# Altium schematic sheet Lighting.SchDoc
size A; SheetNumber: 3; SheetTotal: 3
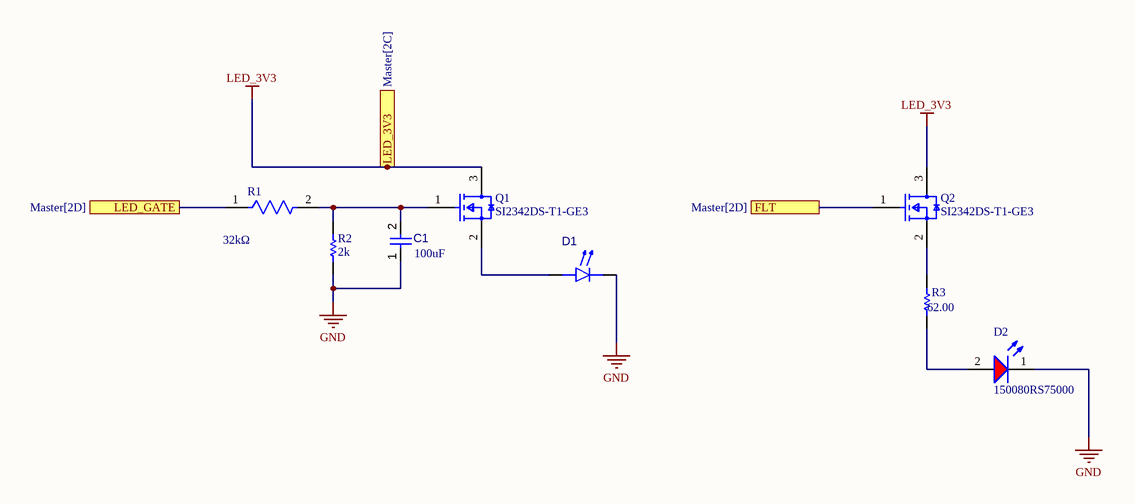
[diagram p0: Lighting.SchDoc]

## Parts
C1  value 100uF  [CAPC3216X19N]  (hidden comment: GRM31CR60J107KEA8L)
D1  HL-AM-2835H489W-S1-08HL-HR3  [HL-AM-2835H489W-S1-08HL-HR3-Footprint-1]  (value not drawn)
D2  150080RS75000  [WL-SMCW_0805_150080xx75000]
Q1  SI2342DS-T1-GE3  [FP-S-03946-MFG]
Q2  SI2342DS-T1-GE3  [FP-S-03946-MFG]
R1  Resistance: 32kΩ  [FP-RT0603-0_55-MFG]  (hidden comment: RT0603BRD0732KL)
R2  2k  [RESC1608X55X30ML15T15]
R3  value 62.00  [RESC1206(3216)_N]  (hidden comment: 62R 1% 1206(3216))

## Ports
FLT (see Master[2D]), LED_3V3 (see Master[2C]), LED_GATE (see Master[2D])

## Nets
GND: C1.1 D1.1(K) D2.1(K) R2.1
LED_3V3: Q1.3(D) Q2.3(D) ; port LED_3V3
FLT: Q2.1(G) ; port FLT
LED_GATE: R1.1 ; port LED_GATE
NetC1_2: C1.2 Q1.1(G) R1.2 R2.2
NetD1_2: D1.2(A) Q1.2(S)
NetD2_2: D2.2(A) R3.2
NetQ2_2: Q2.2(S) R3.1

## Library data of the parts
C1 = CMP-001-00083-1: 6.3V 100uF X5R ¡À10% 1206 Multilayer Ceramic Capacitors MLCC - SMD/SMT ROHS
D1 = CMP-007-00036-1
D2 = CMP-1426-00011-3: LED Uni-Color Red 630nm 2-Pin Chip 0805(2012Metric) T/R; Viewing Angle: 140°; Max Junction Temperature (Tj): 95°C; Power Dissipation: 72mW; Forward Current: 100mA; Forward Voltage: 2V; Wavelength: 625nm; Test Current: 20mA; Max Reverse Voltage (DC): 5V; Luminous Intensity: 150mcd; Lens Style: Clear, Rectangular; REACH SVHC: Unknown; Height: 700µm; Case Code (Metric): 2012; Peak Wavelength: 630nm; Length: 2mm; Width: 1.25mm; RoHS: Compliant; Packaging: Tape and Reel; Dominant Wavelength: 625nm; Color: Red; Case Code (Imperial): 0805; Min Operating Temperature: -40°C; Mount: Surface Mount; Max Operating Temperature: 85°C; Case/Package: 0805
Q1 Q2 = CMP-02550-000018-1: MOSFET N-CH 8V 6A SOT-23; Manufacturer: Vishay; Number Of N Channels: 1; Pulse Drain Current: 30A; Reverse Recovery Charge: 17nC; Depletion Mode: False; Reverse Recovery Time: 40ns; Max Junction Temp: +150°C; Power Dissipation: 1.3W; Transconductance: 75S; Threshold Vgs Min: 0.35V; Turn Off Delay Time: 65ns; Rthja Max: 75°C/W; Input Capacitace At Vds: 1070pF @ 4V; Gate Charge At Vgs: 10.5nC @ 4.5V; Gate To Source Voltage: 5V; Turn On Delay Time: 6ns; Drain To Source Resistance: 0.014Ω; Typ Forward Diode Voltage: 0.82V; Standoff Height: 0.01mm; Max Forward Diode Voltage: 1.2V; Threshold Vgs Max: 0.8V; Continuous Drain Current: 6A; Device Class L1: Discrete Semiconductors; Mouser Description: MOSFET 8V 6A 2.5; Category: Trans; Digikey Description: MOSFET N-CH 8V 6A SOT-23; Manufacturer Part Number: SI2342DS-T1-GE3; Device Class L2: Transistors; Octopart: https://octopart.com/si2342ds-t1-ge3-vishay-45050957; ComponentLink2URL: https://www.vishay.com/docs/63302/si2342ds.pdf; RoHS: TRUE; Drain To Source Breakdown Voltage: 8V; Height: 1.12mm; Lead Free: Yes; Temperature Range Low: -55°C; Package: S-03946; Device Class L3: MOSFETs; Temperature Range High: +150°C; Ipc Land Pattern Name: SOT95P237X100-3; Drain To Source Voltage: 8V; Temperature: -55°C to +150°C; ComponentLink2Description: Datasheet; Number Of Channels: 1; Automotive: No
R1 = CMP-00621-34935746-1: RT0603BRD0732KL High Precision-High Stability Chip Resistor Thin Film 0603 32kOhm 0.1% Paper T/R; Temperature Coefficient: 25ppm/°C; Max Power Dissipation: 100mW; Case/Package: 0603; Composition: Thin Film; Features: Moisture Resistant; Packaging: Tape & Reel; RoHS: Compliant; Height: 558.8µm; Max Operating Temperature: 155°C; NexarPartId: 34935746; Number of Terminations: 2; Length: 1.6002mm; Width: 787.4µm; Tolerance: 0.1%; Min Operating Temperature: -55°C
R2 = CMP-2000-00317-1: Part Number: ERJ-3EKF2001V; Manufacturer: Panasonic
R3 = CMP-1014-00373-1: 62R 0.25W 1% 1206 (3216 Metric)  SMD; Case-Metric: 3216; Case-EIA: 1206; Power: 0.25 W; Technology: SMT; Tolerance: 1 %